# EAGLE design stacker (EAGLE 9.6.1)
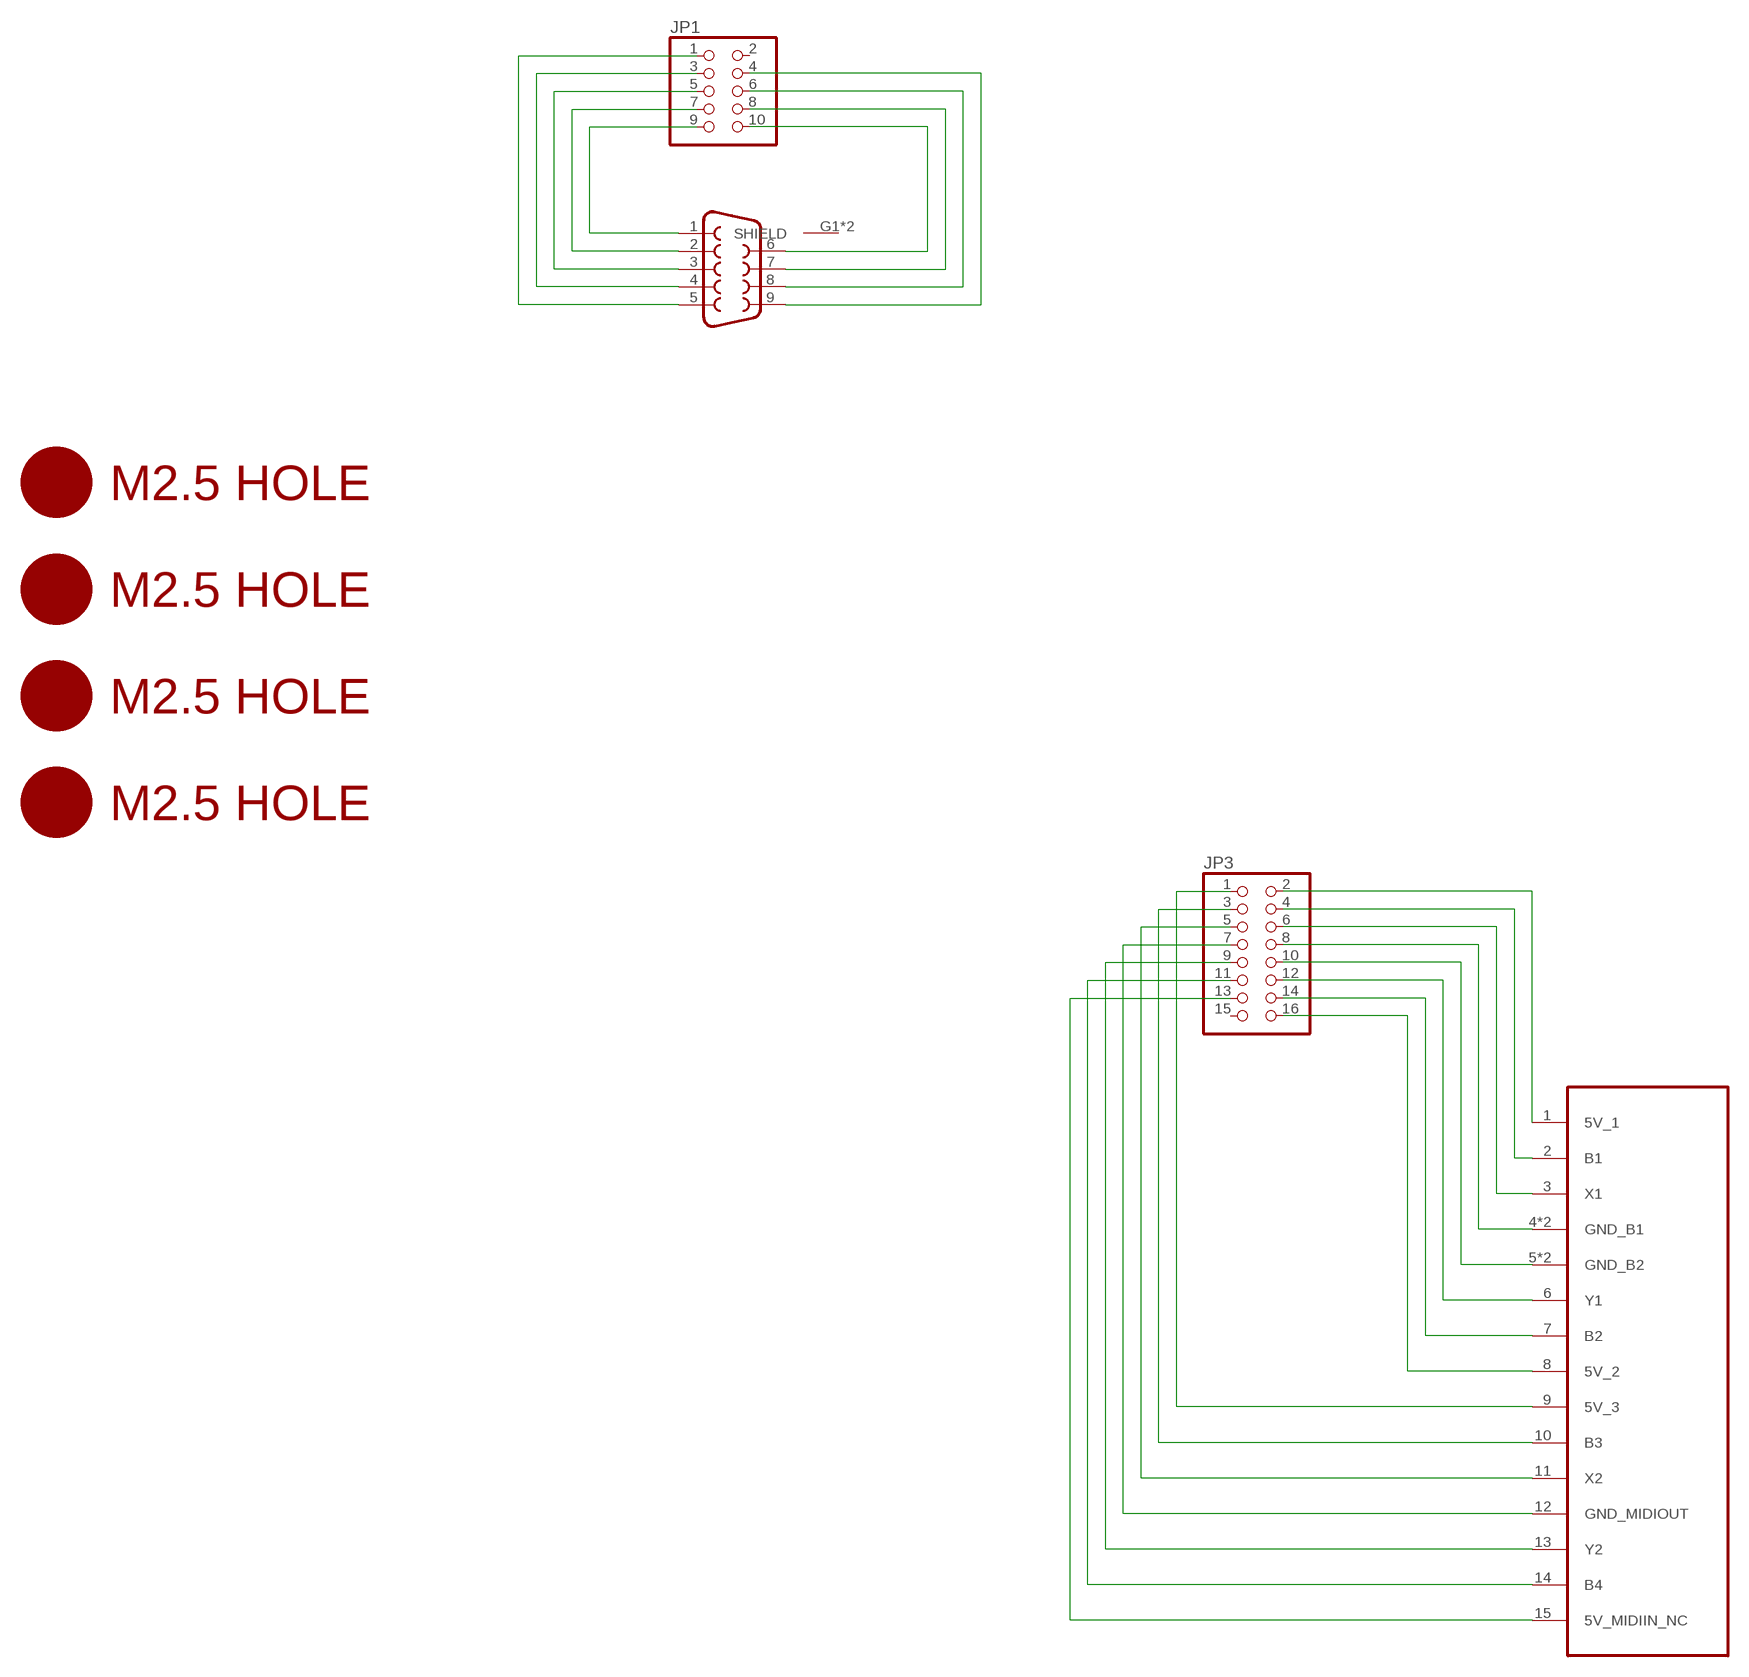
[diagram p0: schematic, sheet 1]

## Parts
J5  DB9MALE  [DB9_MALE]
JP1  PINHD-2X5  [2X05]
JP3  PINHD-2X8  [2X08]
U$2  M2.5HOLE  [M2.5HOLE]
U$3  M2.5HOLE  [M2.5HOLE]
U$4  M2.5HOLE  [M2.5HOLE]
U$5  M2.5HOLE  [M2.5HOLE]
U$11  GAMEPORT_15P  [DA15]

## Nets
N$1: J5.1 JP1.9
N$2: J5.2 JP1.7
N$3: J5.3 JP1.5
N$4: J5.4 JP1.3
N$5: J5.5 JP1.1
N$6: J5.6 JP1.10
N$7: J5.7 JP1.8
N$8: J5.8 JP1.6
N$9: J5.9 JP1.4
N$10: JP3.2 U$11.1(5V_1)
N$11: JP3.4 U$11.2(B1)
N$12: JP3.6 U$11.3(X1)
N$13: JP3.8 U$11.4(GND_B1) U$11.G1(GND_B1)
N$14: JP3.10 U$11.5(GND_B2) U$11.G2(GND_B2)
N$15: JP3.12 U$11.6(Y1)
N$16: JP3.14 U$11.7(B2)
N$17: JP3.16 U$11.8(5V_2)
N$18: JP3.1 U$11.9(5V_3)
N$19: JP3.3 U$11.10(B3)
N$20: JP3.5 U$11.11(X2)
N$21: JP3.7 U$11.12(GND_MIDIOUT)
N$22: JP3.9 U$11.13(Y2)
N$23: JP3.11 U$11.14(B4)
N$24: JP3.13 U$11.15(5V_MIDIIN_NC)
Unconnected: J5.G1(SHIELD) J5.G2(SHIELD) JP1.2 JP3.15

## Library data of the parts
J5 = SparkFun-Connectors:DB9: DB9 Connector Standard DB9 (D-Sub 9) serial connector. Can be used for CAN bus as well as RS485 and RS232. Footprint production proven. Here is the female version connector we sell at SparkFun: 9 Pin Female Serial Connector - PCB Mount <https://www.sparkfun.com/products/429> (PRT-00429) This connector has been used on the following SparkFun products: SparkFun RS232 Shifter - SMD <https://www.sparkfun.com/products/449> (PRT-00449) SparkFun RS232 Shifter SMD (No DB9) <https://www.sparkfun.com/products/8780> (PRT-08780); PROD_ID: CONN-09904
JP1 = pinhead:PINHD-2X5: PIN HEADER
JP3 = pinhead:PINHD-2X8: PIN HEADER
U$2-U$5 = f1c100s:M2.5HOLE
U$11 = ibmpc:GAMEPORT_15P

## Net classes
1 power: width 0.178 mm

## Board
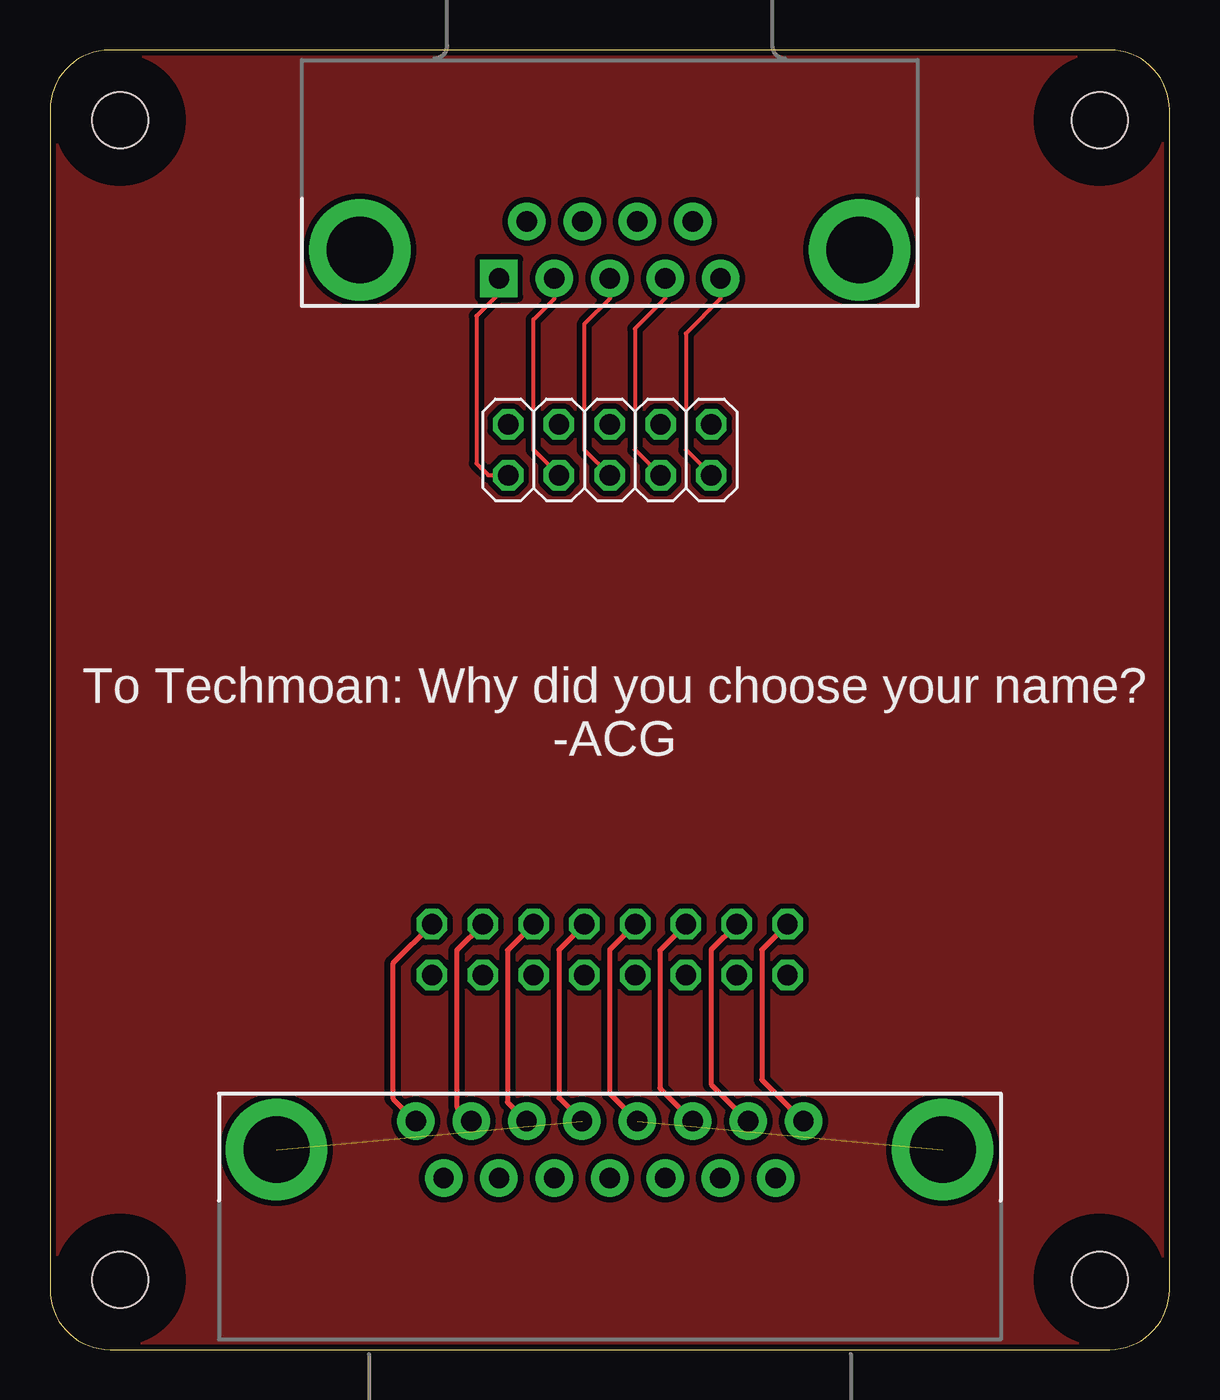
[diagram p1: board, top side]
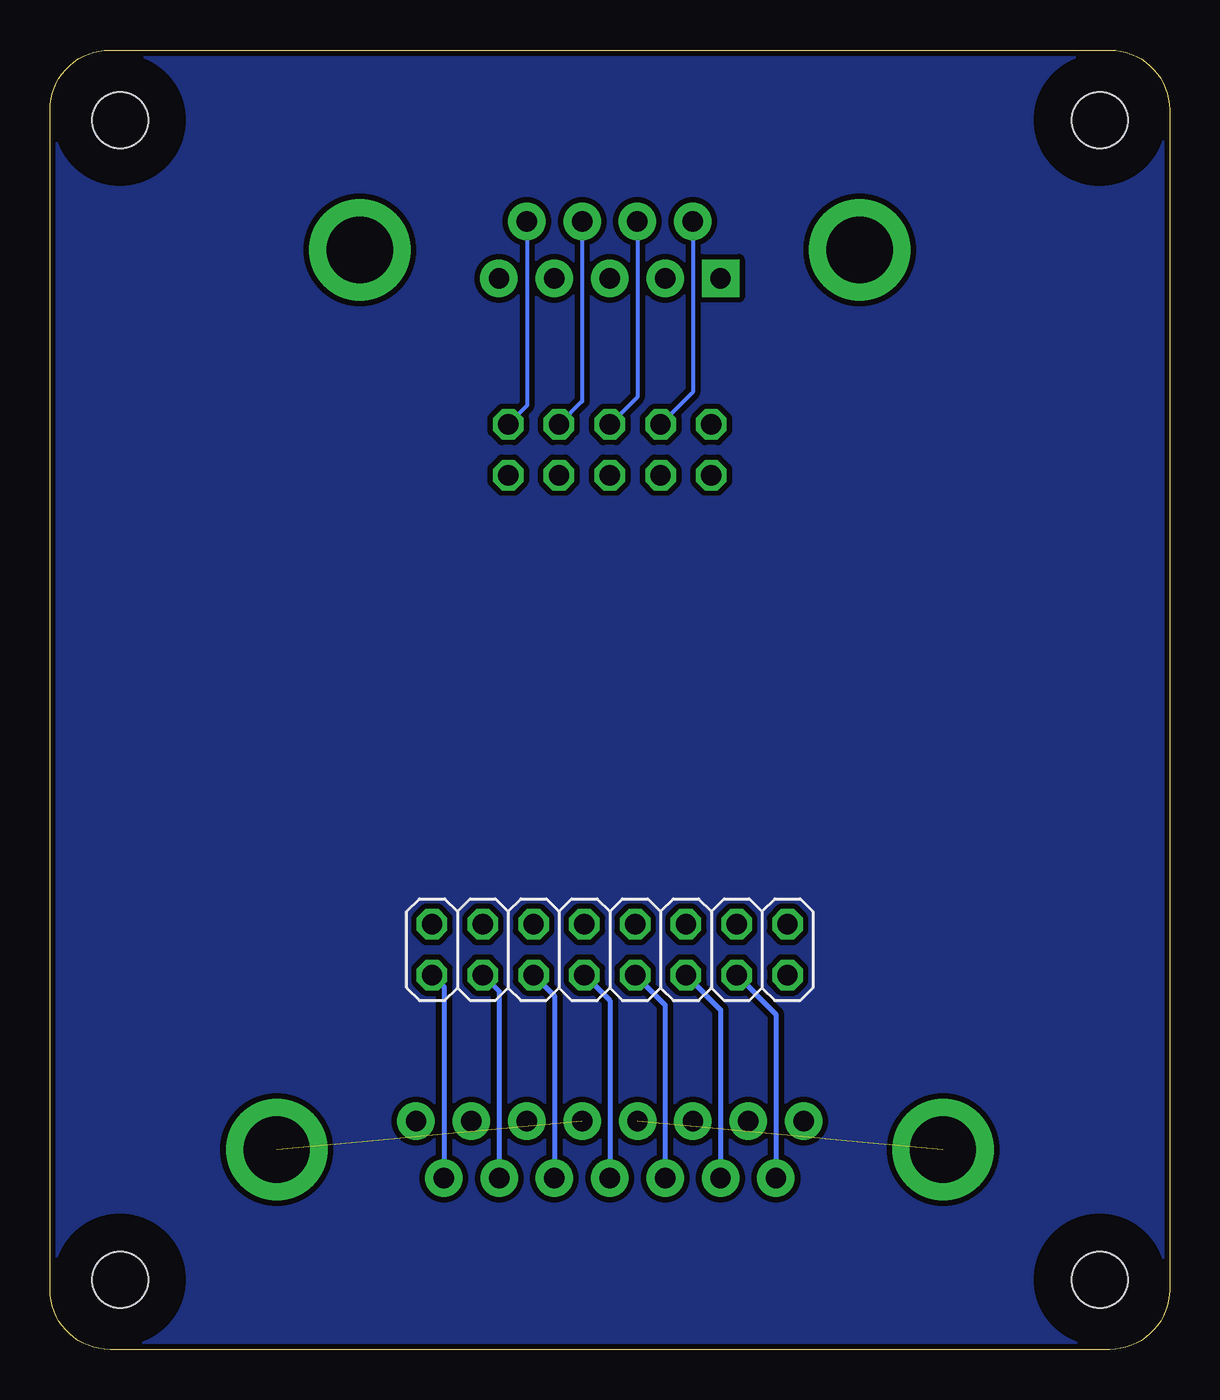
[diagram p2: board, bottom side, seen from below]

Size 56 x 65 mm. Coordinates in mm from the lower left corner, seen from the top.
Outline: 3,0 53,0 arc90 56,3 56,62 arc90 53,65 3,65 arc90 0,62 0,3 arc90 3,0
Copper layers (1*16): Top 0.035mm / dielectric 1.5mm / Bottom 0.035mm
Design rules "deku_2layer_6mil": minimum track width 6mil, minimum drill 15mil, track to track 6mil, track to pad 6mil, pad to pad 6mil, via to via 6mil, smd to smd 6mil, copper to edge 10mil, drill to drill 6mil, minimum pad ring 7mil, minimum via ring 7mil, stop-mask expansion 4mil, vias tented up to drill 25mil, thermal gap 10mil

### Footprints (pad centres in the part's own frame; a part is rotated, then mirrored left to right if it is on the bottom)
DB9_MALE = drill 1.016 pad 1.88: 1 5.54,-1.42; 2 2.77,-1.42; 3 0,-1.42; 4 -2.77,-1.42; 6 4.15,1.42; 7 1.38,1.42; 8 -1.38,1.42; 9 -4.15,1.42 | drill 1.016 pad 1.88 square: 5 -5.54,-1.42 | drill 3.302 pad 5.08: G1 -12.5,0; G2 12.5,0
2X05 = drill 1.016 octagon: 1 -5.08,-1.27; 2 -5.08,1.27; 3 -2.54,-1.27; 4 -2.54,1.27; 5 0,-1.27; 6 0,1.27; 7 2.54,-1.27; 8 2.54,1.27; 9 5.08,-1.27; 10 5.08,1.27
2X08 = drill 1.016 octagon: 1 -8.89,-1.27; 2 -8.89,1.27; 3 -6.35,-1.27; 4 -6.35,1.27; 5 -3.81,-1.27; 6 -3.81,1.27; 7 -1.27,-1.27; 8 -1.27,1.27; 9 1.27,-1.27; 10 1.27,1.27; 11 3.81,-1.27; 12 3.81,1.27; 13 6.35,-1.27; 14 6.35,1.27; 15 8.89,-1.27; 16 8.89,1.27
M2.5HOLE = hole 2.8: 0,0
DA15 = drill 1.016 pad 1.88: 1 -9.69,-1.42; 2 -6.92,-1.42; 3 -4.15,-1.42; 4 -1.38,-1.42; 5 1.39,-1.42; 6 4.16,-1.42; 7 6.93,-1.42; 8 9.7,-1.42; 9 -8.3,1.42; 10 -5.53,1.42; 11 -2.77,1.42; 12 0,1.42; 13 2.77,1.42; 14 5.54,1.42; 15 8.31,1.42 | drill 3.302 pad 5.08: G1 -16.66,0; G2 16.67,0

### Placement (x,y rotation side)
J5  28,55 0 top
JP1  28,45 0 top
JP3  28,20 0 bottom
U$2  3.5,3.5 0 top
U$3  52.5,3.5 0 top
U$4  3.5,61.5 0 top
U$5  52.5,61.5 0 top
U$11  28,10 180 top

### Tracks (layer width: path | path; a pad name or v marks a point on that pad's centre or on a via)
+3V3
  pour Bottom (isolate 0.279, rank 2): 0,3 0,62 arc-90 3,65 53,65 arc-90 56,62 56,3 arc-90 53,0 3,0 arc-90
GND
  pour Top (isolate 0.279): 3,0 53,0 arc90 56,3 56,62 arc90 53,65 3,65 arc90 0,62 0,3 arc90
N$1
  Top 0.203: J5.1 33.54,52.56 31.8,50.83 31.8,45.01 JP1.9
N$2
  Top 0.203: J5.2 30.77,52.56 29.26,51.05 29.26,45.01 JP1.7
N$3
  Top 0.203: J5.3 28,52.56 26.72,51.28 26.72,45.01 JP1.5
N$4
  Top 0.203: JP1.3 24.18,45.01 24.18,51.52 25.23,52.56 J5.4 | JP1.3
N$5
  Top 0.203: J5.5 22.46,52.82 21.34,51.69 21.34,44.32 21.93,43.73 JP1.1
N$6
  Bottom 0.203: J5.6 32.15,47.2 JP1.10
N$7
  Bottom 0.203: J5.7 29.38,47.43 JP1.8
N$8
  Bottom 0.203: J5.8 26.62,47.65 JP1.6
N$9
  Bottom 0.203: J5.9 23.85,47.88 JP1.4
N$10
  Top 0.254: JP3.2 35.61,19.99 35.61,13.5 U$11.1
N$11
  Top 0.254: JP3.4 33.07,19.99 33.07,13.27 U$11.2
N$12
  Top 0.254: JP3.6 30.5,19.96 30.5,13.06 U$11.3
N$13  (1 unrouted)
  Top 0.254: JP3.8 27.99,19.99 27.99,12.81 U$11.4
N$14  (1 unrouted)
  Top 0.254: JP3.10 25.45,19.99 25.45,12.58 U$11.5
N$15
  Top 0.254: JP3.12 22.89,19.96 22.89,12.38 U$11.6
N$16
  Top 0.254: JP3.14 20.34,19.96 20.34,12.14 U$11.7
N$17
  Top 0.254: JP3.16 17.14,19.3 17.14,12.57 U$11.8
N$18
  Bottom 0.254: JP3.1 36.3,18.14 U$11.9
N$19
  Bottom 0.254: JP3.3 33.53,17.91 U$11.10
N$20
  Bottom 0.254: JP3.5 30.77,17.69 U$11.11
N$21
  Bottom 0.254: JP3.7 28,17.46 U$11.12
N$22
  Bottom 0.254: JP3.9 25.23,17.23 U$11.13
N$23
  Bottom 0.254: JP3.11 22.46,17 U$11.14
N$24
  Bottom 0.254: JP3.13 19.69,16.77 U$11.15

### Text on the board
tNames: To Techmoan: Why did you choose your name? / -ACG